# EAGLE design Railbooster Shield (EAGLE 7.2.0)
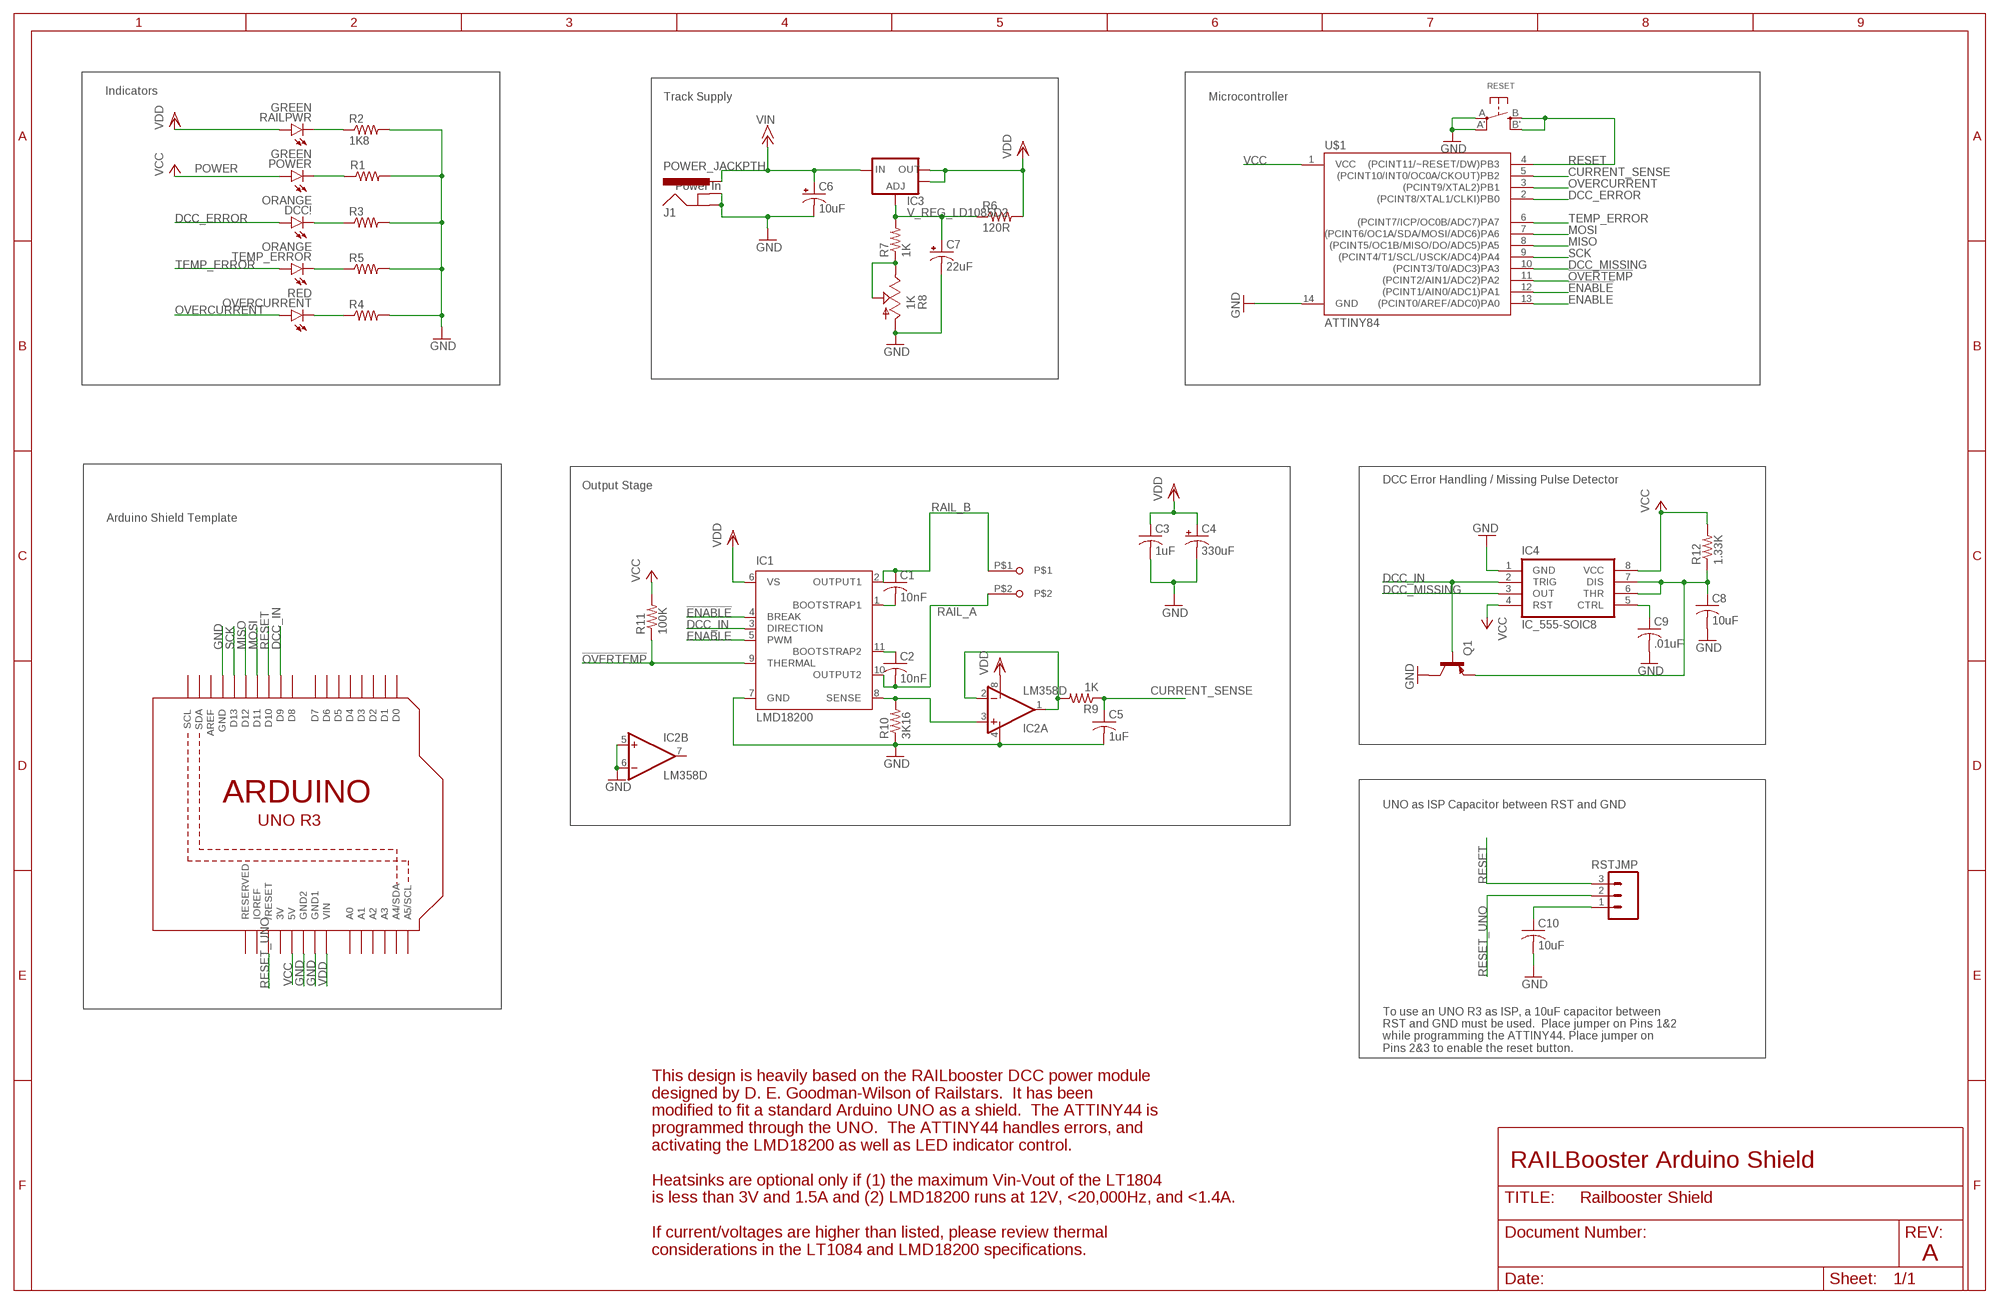
[diagram p0: schematic, sheet 1]

## Parts
C1  10nF  C-USC1206  [C1206]
C2  10nF  C-USC1206  [C1206]
C3  1uF  C-USC1206  [C1206]
C4  330uF  CPOL-USE5-10.5  [E5-10,5]
C5  1uF  C-USC1206  [C1206]
C6  10uF  CPOL-USE2-5  [E2-5]
C7  22uF  CPOL-USE2-5  [E2-5]
C8  10uF  C-USC1206  [C1206]
C9  .01uF  C-USC1206  [C1206]
C10  10uF  C-USC1206  [C1206]
DCC!  ORANGE  LED1206  [LED-1206]
IC1  LMD18200  LM18200T  [TO-220-11]
IC2  LM358D  [SO08]
IC3  V_REG_LD1085D2  [D2PACK/A]
IC4  IC_555-SOIC8  [SOIC-8]
J1  POWER_JACKPTH  [POWER_JACK_PTH]
OVERCURRENT  RED  LED1206  [LED-1206]
POWER  GREEN  LED1206  [LED-1206]
Q1  TRANSISTOR_BJT_PNP-SOT-23-BCE  [SOT-23]
R1  RESISTOR1206  [1206]
R2  1K8  RESISTOR1206  [1206]
R3  RESISTOR1206  [1206]
R4  RESISTOR1206  [1206]
R5  RESISTOR1206  [1206]
R6  120R  RESISTOR1206  [1206]
R7  1K  RESISTOR1206  [1206]
R8  1K  TRIM_US-S64W  [S64W]
R9  1K  RESISTOR1206  [1206]
R10  3K16  RESISTOR1206  [1206]
R11  100K  RESISTOR1206  [1206]
R12  1.33K  RESISTOR1206  [1206]
RAILPWR  GREEN  LED1206  [LED-1206]
RESET  SWITCH_TACT_SMT  [EVQ-Q2]
RSTJMP  M03PTH  [1X03]
TEMP_ERROR  ORANGE  LED1206  [LED-1206]
U1  ARDUINOR3-DIMENSION  [ARDUINOR3]
U$1  ATTINY84  [SO14]
X4  SCREWTERMINAL-5.08-2  [SCREWTERMINAL-5.08-2]

## Nets
!ENABLE: IC1.4(BREAK) U$1.12((PCINT1/AIN0/ADC1)PA1)
!OVERTEMP: IC1.9(THERMAL) R11.1 U$1.11((PCINT2/AIN1/ADC2)PA2)
CTRL: C9.1 IC4.5(CTRL)
CURRENT_SENSE: C5.1 R9.1 U$1.5((PCINT10/INT0/OC0A/CKOUT)PB2)
CURRENT_SENSE_UNBUFFERED: IC2.1(A:OUT) IC2.2(A:-IN) R9.2
DCC_ERROR: DCC!.A U$1.2((PCINT8/XTAL1/CLKI)PB0)
DCC_IN: IC1.3(DIRECTION) IC4.2(TRIG) Q1.1(B) U1.D9
DCC_MISSING: IC4.3(OUT) U$1.10((PCINT3/T0/ADC3)PA3)
ENABLE: IC1.5(PWM) U$1.13((PCINT0/AREF/ADC0)PA0)
GND: C3.2 C4.- C5.2 C6.- C7.- C8.2 C9.2 C10.2 IC1.7(GND) IC2.4(P:V-) IC2.5(B:+IN) IC2.6(B:-IN) IC4.1(GND) J1.GND J1.GNDBREAK Q1.2(C) R1.2 R2.2 R3.2 R4.2 R5.2 R8.A R10.1 RESET.A'(P1) RESET.A(P) U1.GND U1.GND1 U1.GND2 U$1.14(GND)
MISO: U1.D12 U$1.8((PCINT5/OC1B/MISO/DO/ADC5)PA5)
MOSI: U1.D11 U$1.7((PCINT6/OC1A/SDA/MOSI/ADC6)PA6)
N$1: R7.1 R8.E R8.S
N$2: C1.2 IC1.1(BOOTSTRAP1)
N$3: C2.1 IC1.11(BOOTSTRAP2)
N$4: IC1.8(SENSE) IC2.3(A:+IN) R10.2
N$5: POWER.C R1.1
N$6: C7.+ IC3.1(ADJ) R6.1 R7.2
N$7: C10.1 RSTJMP.1
N$8: DCC!.C R3.1
N$9: R5.1 TEMP_ERROR.C
N$13: R2.1 RAILPWR.C
N$14: C8.1 IC4.6(THR) IC4.7(DIS) Q1.3(E) R12.1
N$15: OVERCURRENT.C R4.1
OVERCURRENT: OVERCURRENT.A U$1.3((PCINT9/XTAL2)PB1)
RAIL_A: C2.2 IC1.10(OUTPUT2) X4.P$2
RAIL_B: C1.1 IC1.2(OUTPUT1) X4.P$1
RESET: RESET.B'(S1) RESET.B(S) RSTJMP.3 U1.D10 U$1.4((PCINT11/~RESET/DW)PB3)
RESET_UNO: RSTJMP.2 U1.RESET(/RESET)
SCK: U1.D13 U$1.9((PCINT4/T1/SCL/USCK/ADC4)PA4)
TEMP_ERROR: TEMP_ERROR.A U$1.6((PCINT7/ICP/OC0B/ADC7)PA7)
VCC: IC4.4(RST) IC4.8(VCC) POWER.A R11.2 R12.2 U1.5V U$1.1(VCC)
VDD: C3.1 C4.+ IC1.6(VS) IC2.8(P:V+) IC3.2(OUT) IC3.TAB(OUT) R6.2 RAILPWR.A U1.VIN
VIN: C6.+ IC3.3(IN) J1.PWR
Unconnected: IC2.7(B:OUT) U1.A0 U1.A1 U1.A2 U1.A3 U1.A4(A4/SDA) U1.A5(A5/SCL) U1.AREF U1.D0 U1.D1 U1.D2 U1.D3 U1.D4 U1.D5 U1.D6 U1.D7 U1.D8 U1.IOREF U1.RESERVED U1.SCL U1.SDA

## Notes on the sheet
- Indicators
- Track Supply | Microcontroller
- POWER
- Power In
- DCC Error Handling / Missing Pulse Detector
- Output Stage
- Arduino Shield Template
- UNO as ISP Capacitor between RST and GND
- To use an UNO R3 as ISP, a 10uF capacitor between
  RST and GND must be used.  Place jumper on Pins 1&2
  while programming the ATTINY44. Place jumper on
  Pins 2&3 to enable the reset button.
- RAILBooster Arduino Shield
- This design is heavily based on the RAILbooster DCC power module
  designed by D. E. Goodman-Wilson of Railstars.  It has been
  modified to fit a standard Arduino UNO as a shield.  The ATTINY44 is
  programmed through the UNO.  The ATTINY44 handles errors, and 
  activating the LMD18200 as well as LED indicator control.
  
  Heatsinks are optional only if (1) the maximum Vin-Vout of the LT1804
  is less than 3V and 1.5A and (2) LMD18200 runs at 12V, <20,000Hz, and <1.4A.
  
  If current/voltages are higher than listed, please review thermal
  considerations in the LT1084 and LMD18200 specifications.
- A

## Power pins joined to a net without a drawn wire
3V: U1.3V

## Library data of the parts
C1-C3 C5 C8-C10 = resistor:C-US: CAPACITOR, American symbol
C4 C6 C7 = rcl:CPOL-US: POLARIZED CAPACITOR, American symbol
DCC! OVERCURRENT POWER RAILPWR TEMP_ERROR = SparkFun-LED:LED: LEDs Standard schematic elements and footprints for 5mm, 3mm, 1206, and 0603 sized LEDs. 5mm - Spark Fun Electronics SKU : COM-00529 (and others)
IC1 = national-semiconductor:LM18200T: 3A, 55V H-Bridge Motor Control SourcE: http://cache.national.com/ds/LM/LMD18200.pdf; OC_FARNELL: unknown; OC_NEWARK: unknown
IC2 = linear:LM358: OP AMP also LM158; LM258; LM2904 Source: http://cache.national.com/ds/LM/LM158.pdf
IC3 = SparkFun-PowerIC:V_REG_LD1085: LD1085 3A low-drop positive voltage regulator, adjustable The LD1085xx is a low drop voltage regulator able to provide up to 3 A of output current. Dropout is guaranteed at a maximum of 1.2 V at the maximum output current, decreasing at lower loads. The LD1085xx is pin to pin compatible with the older 3-terminal adjustable regulators, but has better performances in term of drop and output tolerance. Available Packages D2PAK/A - 3-pin w/ tabs, SMD
IC4 = dp_devices:IC_555: Classic 555 IC
J1 = SparkFun:POWER_JACK: Power Jack This is the standard 5.5mm barrel jack for power. The PTH is the most common, proven, reliable, footprint. All others are experimental. The Slot footprint only works if the mill layer is transmitted to the PCB fab house so be warned. Spark Fun Electronics SKU : PRT-00119. Mating wall wart : TOL-00298 (and others)
Q1 = dp_devices:TRANSISTOR_BJT_PNP: Most commonly used is SOT23-BEC
R1-R7 R9-R12 = benjamin:RESISTOR: Resistor Basic schematic elements and footprints for 0603, 1206, and PTH resistors.
R8 = pot:TRIM_US-: POTENTIOMETER
RESET = microbuilder:SWITCH_TACT_SMT: SMT Tact Switches 6x6mm - Digikey: P12940SCT-ND KMR2 (4.6x2.8mm) - Digikey: 401-1426-1-ND EVQ-PQHB55 - Light Touch, 160GF (4.5x4.5mm) - Digikey: P8090SCT-ND KMT0 - KMT021 NGJ LHS (etc.) IP68/Waterproof - Digikey: CKN10289CT-ND
RSTJMP = SparkFun-Connectors:M03: Header 3 Standard 3-pin 0.1" header. Use with straight break away headers (SKU : PRT-00116), right angle break away headers (PRT-00553), swiss pins (PRT-00743), machine pins (PRT-00117), and female headers (PRT-00115). Molex polarized connector foot print use with SKU : PRT-08232 with associated crimp pins and housings.
U1 = adafruit:ARDUINOR3: This is a new object for the new Arduino R3 - with extra pins that you may want to use (such as IOref, and duplicated A4/A5
U$1 = SparkFun-DigitalIC:ATTINY84: Atmel 14-pin 2/4/8kB flash uC; PROD_ID: IC-11285
X4 = Artificial Science:SCREWTERMINAL-5.08-2

## Net classes
2 gnd: width 0.305 mm, drill 0.483 mm, clearance 0.203 mm

## Board
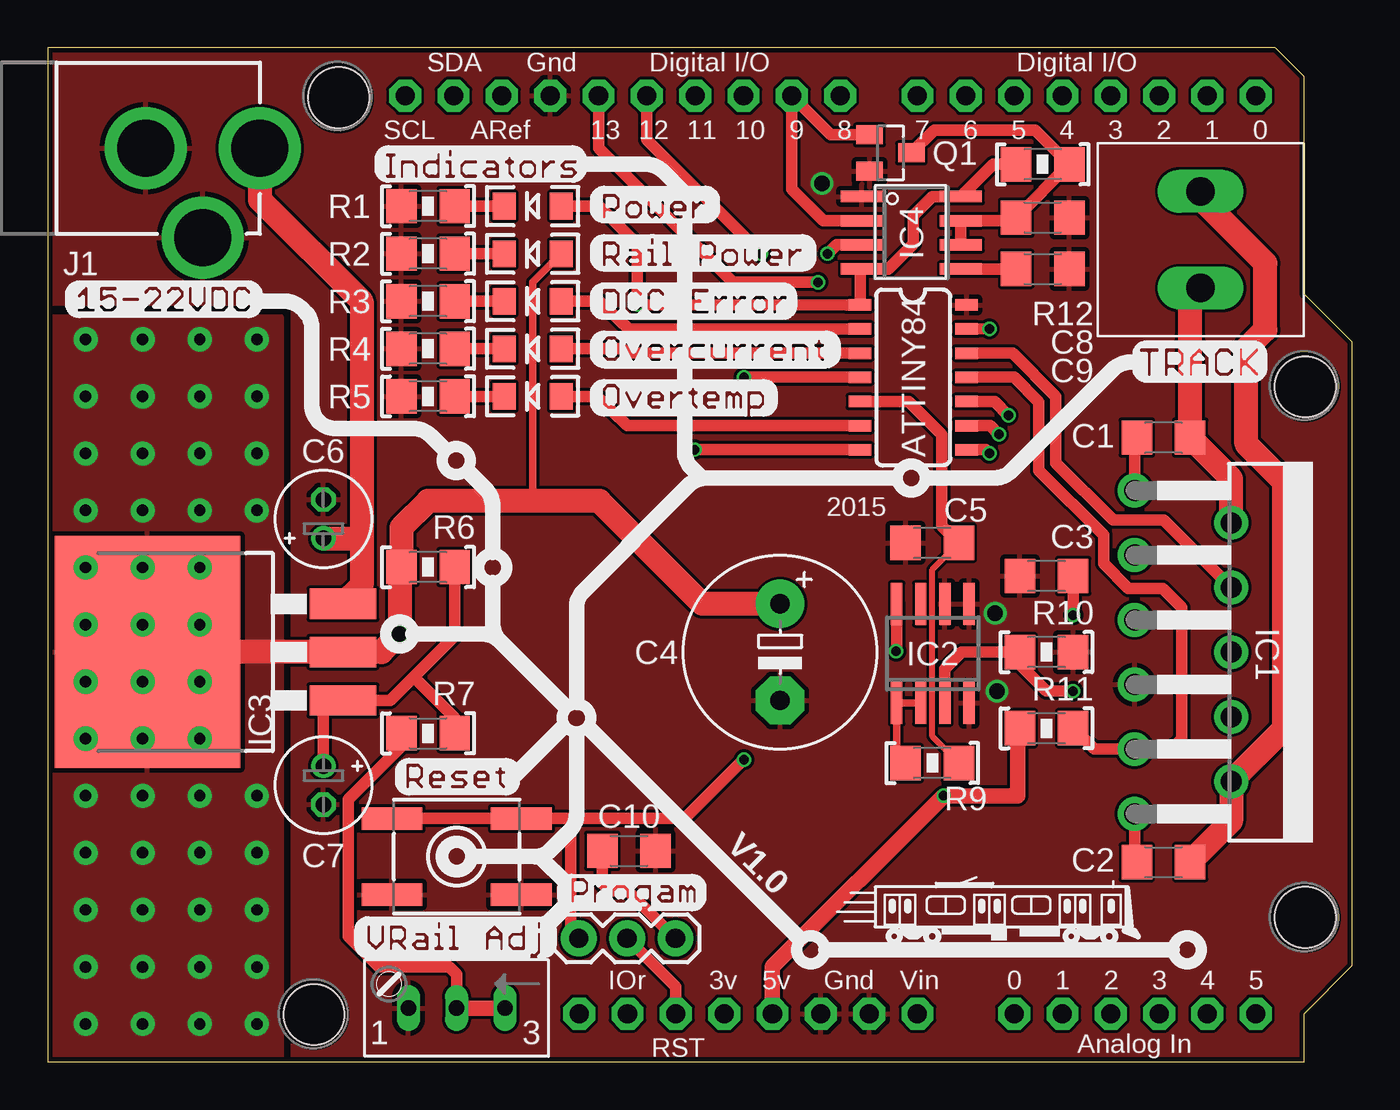
[diagram p1: board, top side]
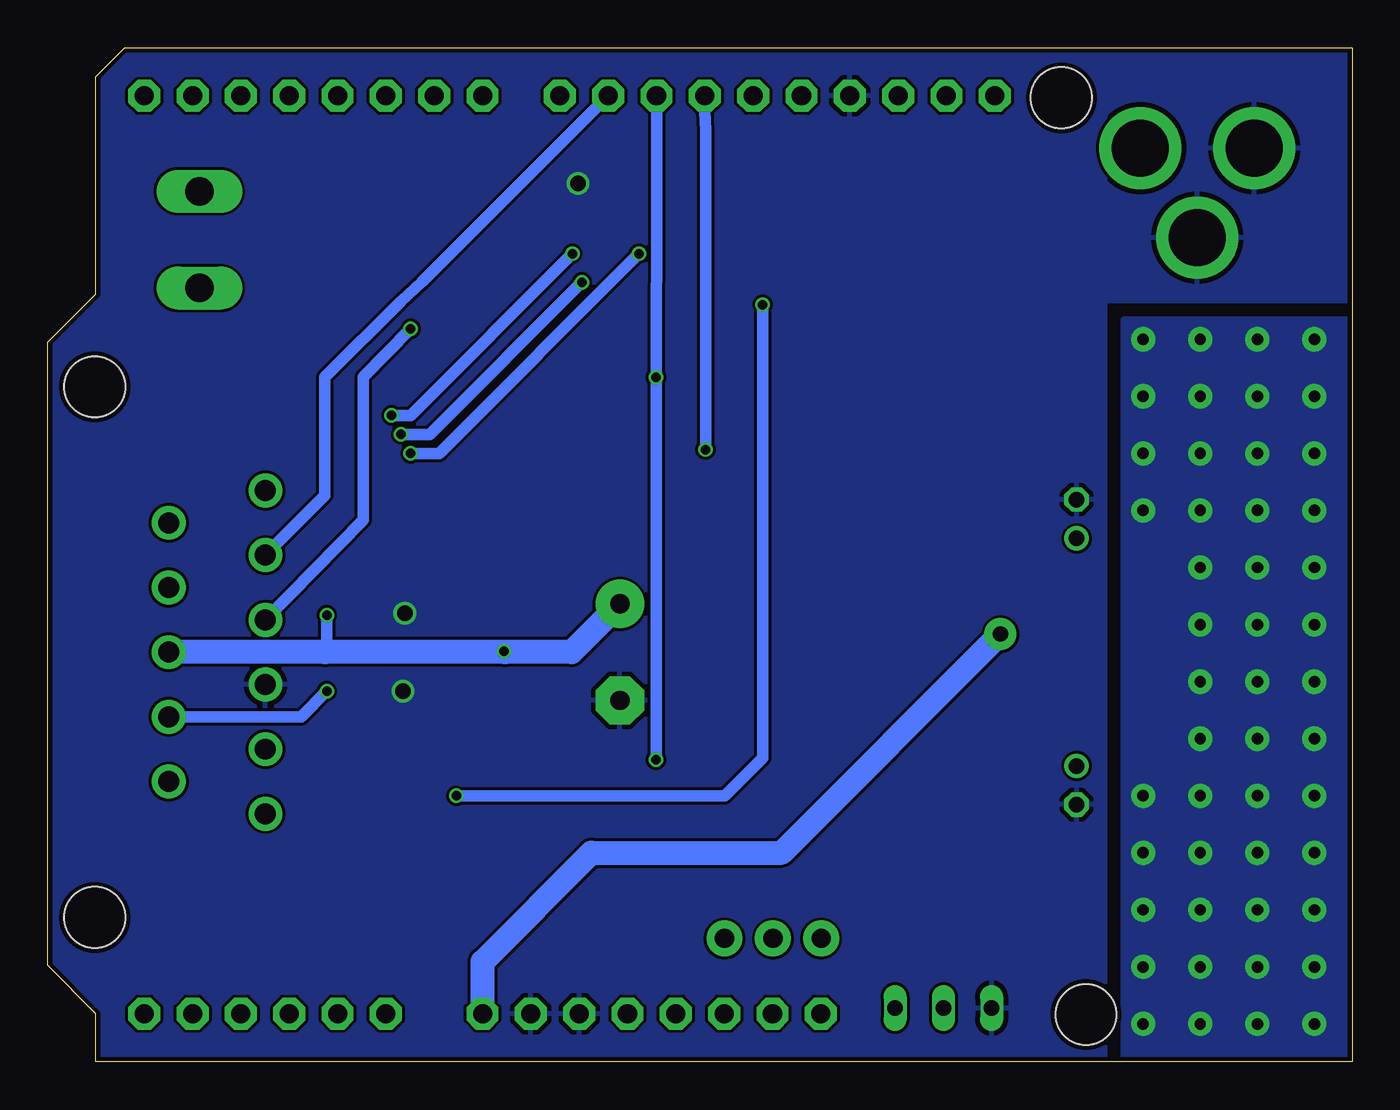
[diagram p2: board, bottom side, seen from below]

Size 68.58 x 53.34 mm. Coordinates in mm from the lower left corner, seen from the top.
Copper layers (1*16): Top 0.035mm / dielectric 1.5mm / Bottom 0.035mm
Design rules "default": minimum track width 6mil, minimum drill 0.3mm, track to track 6mil, track to pad 6mil, pad to pad 6mil, via to via 6mil, smd to smd 0mil, copper to edge 10mil, drill to drill 10mil, minimum pad ring 5mil, minimum via ring 5mil, stop-mask expansion 2mil, vias tented up to drill 100mil, thermal gap 10mil
Holes 3.2 mm at 15.3,50.7 14,2.5 66.1,7.6 66.1,35.5

### Footprints (pad centres in the part's own frame; a part is rotated, then mirrored left to right if it is on the bottom)
C1206 = smd 1.6 x 1.8: 1 -1.4,0; 2 1.4,0
E5-10,5 = drill 1.016 pad 2.54: + -2.54,0 | drill 1.016 pad 2.54 octagon: - 2.54,0
E2-5 = drill 0.813 pad 1.27: + -1.016,0 | drill 0.813 pad 1.27 octagon: - 1.016,0
LED-1206 = smd 1.2 x 1.4: A -1.5,0; C 1.5,0
TO-220-11 = drill 1.1 pad 1.778: 1 -8.5,-9.37; 2 -6.8,-4.29; 3 -5.1,-9.37; 4 -3.4,-4.29; 5 -1.7,-9.37; 6 0,-4.29; 7 1.7,-9.37; 8 3.4,-4.29; 9 5.1,-9.37; 10 6.8,-4.29; 11 8.5,-9.37
SO08 = smd 0.6 x 2.2: 1 -1.905,-2.6; 2 -0.635,-2.6; 3 0.635,-2.6; 4 1.905,-2.6; 5 1.905,2.6; 6 0.635,2.6; 7 -0.635,2.6; 8 -1.905,2.6
D2PACK/A = smd 1.6 x 3.5: 1 -2.54,-8.275; 2 0,-8.275; 3 2.54,-8.275 | smd 12.2 x 9.75: TAB 0,2
SOIC-8 = smd 0.6 x 2.2: 1 -1.905,-2.6; 2 -0.635,-2.6; 3 0.635,-2.6; 4 1.905,-2.6; 5 1.905,2.6; 6 0.635,2.6; 7 -0.635,2.6; 8 -1.905,2.6
POWER_JACK_PTH = drill 2.997 pad 4.318: GND 0,7.7; GNDBREAK 4.7,10.7; PWR 0,13.7
SOT-23 = smd 1 x 1.4: 1 -0.95,-1.1; 2 0.95,-1.1; 3 0,1.1
1206 = smd 1.6 x 1.8: 1 -1.4,0; 2 1.4,0
S64W = drill 0.813 long: A 2.54,1.27; E -2.54,1.27; S 0,1.27
EVQ-Q2 = smd 3.2 x 1.2: A -3.4,-2; A' 3.4,-2; B -3.4,2; B' 3.4,2
1X03 = drill 1.016 pad 1.88: 1 0,0; 2 2.54,0; 3 5.08,0
ARDUINOR3 = drill 1 pad 1.676 octagon: 3V 35.56,2.54; 5V 38.1,2.54; A0 50.8,2.54; A1 53.34,2.54; A2 55.88,2.54; A3 58.42,2.54; A4 60.96,2.54; A5 63.5,2.54; AREF 23.876,50.8; D0 63.5,50.8; D1 60.96,50.8; D2 58.42,50.8; D3 55.88,50.8; D4 53.34,50.8; D5 50.8,50.8; D6 48.26,50.8; D7 45.72,50.8; D8 41.656,50.8; D9 39.116,50.8; D10 36.576,50.8; D11 34.036,50.8; D12 31.496,50.8; D13 28.956,50.8; GND 26.416,50.8; GND1 43.18,2.54; GND2 40.64,2.54; IOREF 30.48,2.54; RESERVED 27.94,2.54; RESET 33.02,2.54; SCL 18.796,50.8; SDA 21.336,50.8; VIN 45.72,2.54
SO14 = smd 0.6 x 1.2: 1 -3.81,-2.8; 2 -2.54,-2.8; 3 -1.27,-2.8; 4 0,-2.8; 5 1.27,-2.8; 6 2.54,-2.8; 7 3.81,-2.8; 8 3.81,2.8; 9 2.54,2.8; 10 1.27,2.8; 11 0,2.8; 12 -1.27,2.8; 13 -2.54,2.8; 14 -3.81,2.8
SCREWTERMINAL-5.08-2 = drill 1.5 long: P$1 0,0; P$2 5.08,0

### Placement (x,y rotation side)
C1  58.65,32.83 180 top
C2  58.65,10.51 0 top
C3  52.5,25.55 180 top
C4  38.5,21.55 270 top
C5  46.5,27.3 180 top
C6  14.5,28.55 90 top
C7  14.5,14.55 270 top
C8  52.3,44.4 0 top
C9  52.3,41.7 0 top
C10  30.56,11.1 0 top
DCC!  25.5,40 180 top
IC1  66.5,21.55 270 top
IC2  46.52,21.48 0 top
IC3  7.25,21.55 90 top
IC4  45.4,43.6 270 top
J1  -2.54,48.05 270 top
OVERCURRENT  25.5,37.5 180 top
POWER  25.5,45 180 top
Q1  44.3,47.8 270 top
R1  20,45 180 top
R2  20,42.5 180 top
R3  20,40 180 top
R4  20,37.5 180 top
R5  20,35 180 top
R6  20,26.02 180 top
R7  20,17.29 0 top
R8  21.5,4.1 180 top
R9  46.5,15.71 180 top
R10  52.5,21.55 180 top
R11  52.5,17.55 180 top
R12  52.3,47.2 180 top
RAILPWR  25.5,42.5 180 top
RESET  21.5,10.8 0 top
RSTJMP  33,6.5 180 top
TEMP_ERROR  25.5,35 180 top
U1  0,0 0 top
U$1  45.5,36 270 top
X4  60.6,40.7 90 top

### Tracks (layer width: path | path; a pad name or v marks a point on that pad's centre or on a via)
!ENABLE
  Top 0.61: U$1.12 50.73,37.27 53,35 53,31.5 56,28.5 58.66,28.5 IC1.4
!OVERTEMP
  Top 0.61: R11.1 55,16.45 IC1.9 59.05,16.45 59.6,17 59.6,23.9 58.6,24.9 56.8,24.9 55.5,26.2 55.5,27.7 52.1,31.1 52.1,34.7 50.8,36 U$1.11
CTRL
  Top 0.61: IC4.5 C9.1
CURRENT_SENSE
  Top 0.305: R9.1 46.5,17.11 46.5,25.89 C5.1
  Top 0.61: U$1.5 45.27,34.73 47,33 47,28.18 C5.1
CURRENT_SENSE_UNBUFFERED
  Top 0.406: IC2.2 IC2.1 44.62,16.2 R9.2
DCC_ERROR
  Top 0.61: U$1.2 30.54,38.54 29,40 DCC!.A
DCC_IN
  Top 0.61: IC4.2 40.77,44.23 39.12,45.88 U1.D9 41.17,48.75 Q1.1
  Bottom 0.61: IC1.3 54,29.78 54,36 50,40 48.92,41 U1.D9
DCC_MISSING  (via drill 0.5)
  Top 0.61: U$1.10 49.77,34.73 v50.5,34 | v41,42.5 41.47,42.97 IC4.3
  Bottom 0.61: v50.5,34 49.5,34 v41,42.5
ENABLE  (via drill 0.5)
  Top 0.61: U$1.13 v49.5,38.55
  Bottom 0.61: IC1.5 52,28.5 52,36 v49.5,38.55
GND  (via drill 0.8)
  other vias: 40.7,46.2 49.9,19.5 49.8,23.6
  pour Bottom: 13,53.34 68.58,53.34 68.58,0 13,0
  pour Bottom (isolate 0.254): 14,53.5 0,53.5 0,40 14,40
  pour Top: -0.02,39.9 12.88,39.9 12.88,0 68.68,0 68.68,53.2 0.08,53.2 0.08,40
MISO  (via drill 0.5)
  Top 0.61: U$1.8 49.31,32.19 v49.5,32 | v37.5,42.5 31.5,48.5 U1.D12
  Bottom 0.61: v49.5,32 48,32 v37.5,42.5
MOSI  (via drill 0.5)
  Top 0.61: v34,32.2 U$1.7
  Bottom 0.61: v34,32.2 34,49 34.04,49.96 U1.D11
N$1
  Top 0.61: R8.S 21.5,4.6 21.1,5 17.4,5 15.8,6.6 15.8,13.8 18.6,16.6 R7.1
  Top 0.813: R8.E R8.S
N$2
  Top 0.61: C1.2 57.13,32.71 IC1.1
N$3
  Top 0.61: C2.1 57.13,10.63 IC1.11
N$4  (via drill 0.5)
  Top 0.61: v53.9,19.5 52.5,19.5 51.1,20.9 R10.2 48.05,21.55 47.16,20.66 IC2.3
  Bottom 0.61: IC1.8 55.25,18.15 v53.9,19.5
N$5
  Top 0.61: POWER.C R1.1
N$6
  Top 0.61: R6.1 21.4,22.4 19.25,20.25 | 19.25,20.25 18,19 IC3.1 14.5,19.01 C7.+ | R7.2 21.4,18.1 19.25,20.25
N$7
  Top 0.61: C10.1 29.14,9.36 29.5,9 30.5,9 RSTJMP.1
N$8
  Top 0.61: DCC!.C R3.1
N$9
  Top 0.61: TEMP_ERROR.C R5.1
N$13
  Top 0.61: RAILPWR.C R2.1
N$14
  Top 0.61: IC4.6 IC4.7 50.73,44.23 arc90 C8.1 R12.1 51.9,49 46.6,49 Q1.3
N$15
  Top 0.61: OVERCURRENT.C R4.1
OVERCURRENT
  Top 0.61: U$1.3 30.43,37.27 30.2,37.5 OVERCURRENT.A
RAIL_A
  Top 1.27: X4.P$2 60.74,45.26 64,42 64,38.5 63,37.5 63,32.5 65,30.5 65,17.54 IC1.10 62.21,12.67 C2.2
RAIL_B
  Top 1.27: IC1.2 62.21,30.67 C1.1 60.05,39.71 X4.P$1
RESET  (via drill 0.5)
  Top 0.61: v36.6,36 U$1.4 | 27.5,12.8 RESET.B' RESET.B | RSTJMP.3 27.5,6.92 27.5,12.8 | v36.6,15.9 33.5,12.8 27.5,12.8
  Bottom 0.61: U1.D10 36.58,45.92 v36.6,36 v36.6,15.9
RESET_UNO
  Top 0.61: RSTJMP.2 33.02,3.94 U1.RESET
SCK  (via drill 0.5)
  Top 0.61: U$1.9 49.54,33.46 v50,33 | v40.5,41 36,41 28.96,48.04 U1.D13
  Bottom 0.61: v50,33 48.5,33 v40.5,41
TEMP_ERROR
  Top 0.61: U$1.6 30.46,33.46 28.9,35 TEMP_ERROR.A
VCC  (via drill 0.5)
  Top 0.61: R12.2 49.7,47.2 IC4.8 46.51,45.51 45.5,44.5 45.5,43 44.2,41.7 IC4.4 42.7,41.59 U$1.1 42.01,39.81 v31,39.82 31,43 29,45 POWER.A
  Top 0.813: U1.5V 38.1,5 v47.1,14 51,14 51,17.45 R11.2
  Bottom 0.61: v31,39.82 31,16 33,14 v47.1,14
VDD  (via drill 0.5, 0.6 pad 1.27, 0.8 pad 1.68)
  Top 0.406: RAILPWR.A 25.5,41 25.5,29.5
  Top 0.61: v53.9,23.5 C3.1 | IC2.8 44.62,21.62 v44.6,21.6
  Top 0.813: R6.2 18.5,25.43
  Top 1.27: C4.+ 34.41,24.09 29,29.5 25.5,29.5 20,29.5 18.6,28.1 R6.2 | 18.5,25.43 v18.5,22.5 17.55,21.55 IC3.2 IC3.TAB
  Bottom 0.61: v53.9,23.5 53.9,21.55 54,21.55 | 44.55,21.55 v44.6,21.6
  Bottom 1.27: C4.+ 41.04,21.55 44.55,21.55 54,21.55 IC1.6 | U1.VIN 45.72,5.28 40,11 30,11 v18.5,22.5
  other vias: 2,8 2,11 5,11 8,11 11,11 11,14 8,14 5,14 2,14 5,8 5,5 2,5 2,2 5,2 8,2 11,2 11,5 11,8 8,8 8,5 2,29 5,29 8,29 11,29 11,32 8,32 5,32 2,32 2,35 5,35 8,35 11,35 11,38 2,38 5,38 8,38 2,26 2,23 2,20 2,17 5,17 5,20 5,23 5,26 8,26 8,23 8,20 8,17
  pour Bottom (isolate 0.254): 0,39 12,39 12,0 0,0
  pour Top: -0.02,39.2 12.28,39.2 12.28,0 -0.02,0
VIN
  Top 1.27: J1.PWR 11.16,45.34 16.5,40 16.5,27.53 | 16.5,27.53 16.5,25.07 IC3.3 | C6.+ 16.5,27.53

### Text on the board
tNames: 2015 | V1.0
_tsilk: Indicators | Power | Rail Power | 15-22VDC | DCC Error | Overcurrent | TRACK | Overtemp | Reset | Progam | VRail Adj